# Altium schematic sheet SY_HR08_MCU_IO_V1.1.SchDoc
size A3; PageSetup: Record=PageOptions|CenterHorizontal=True|CenterVertical=True|PrintScale=0.71|XCorrection=1.00|YCorrection=1.00|PrintKind=2|BorderSize=5000000|LeftOffset=0|BottomOffset=0|Orientation=2|PaperLength=1000|PaperWidth=1000|Scale=100|PaperSource=7|PrintQuality=-3|MediaType=1|DitherType=10|PrintScaleMode=1|PaperKind=A4|PaperIndex=9
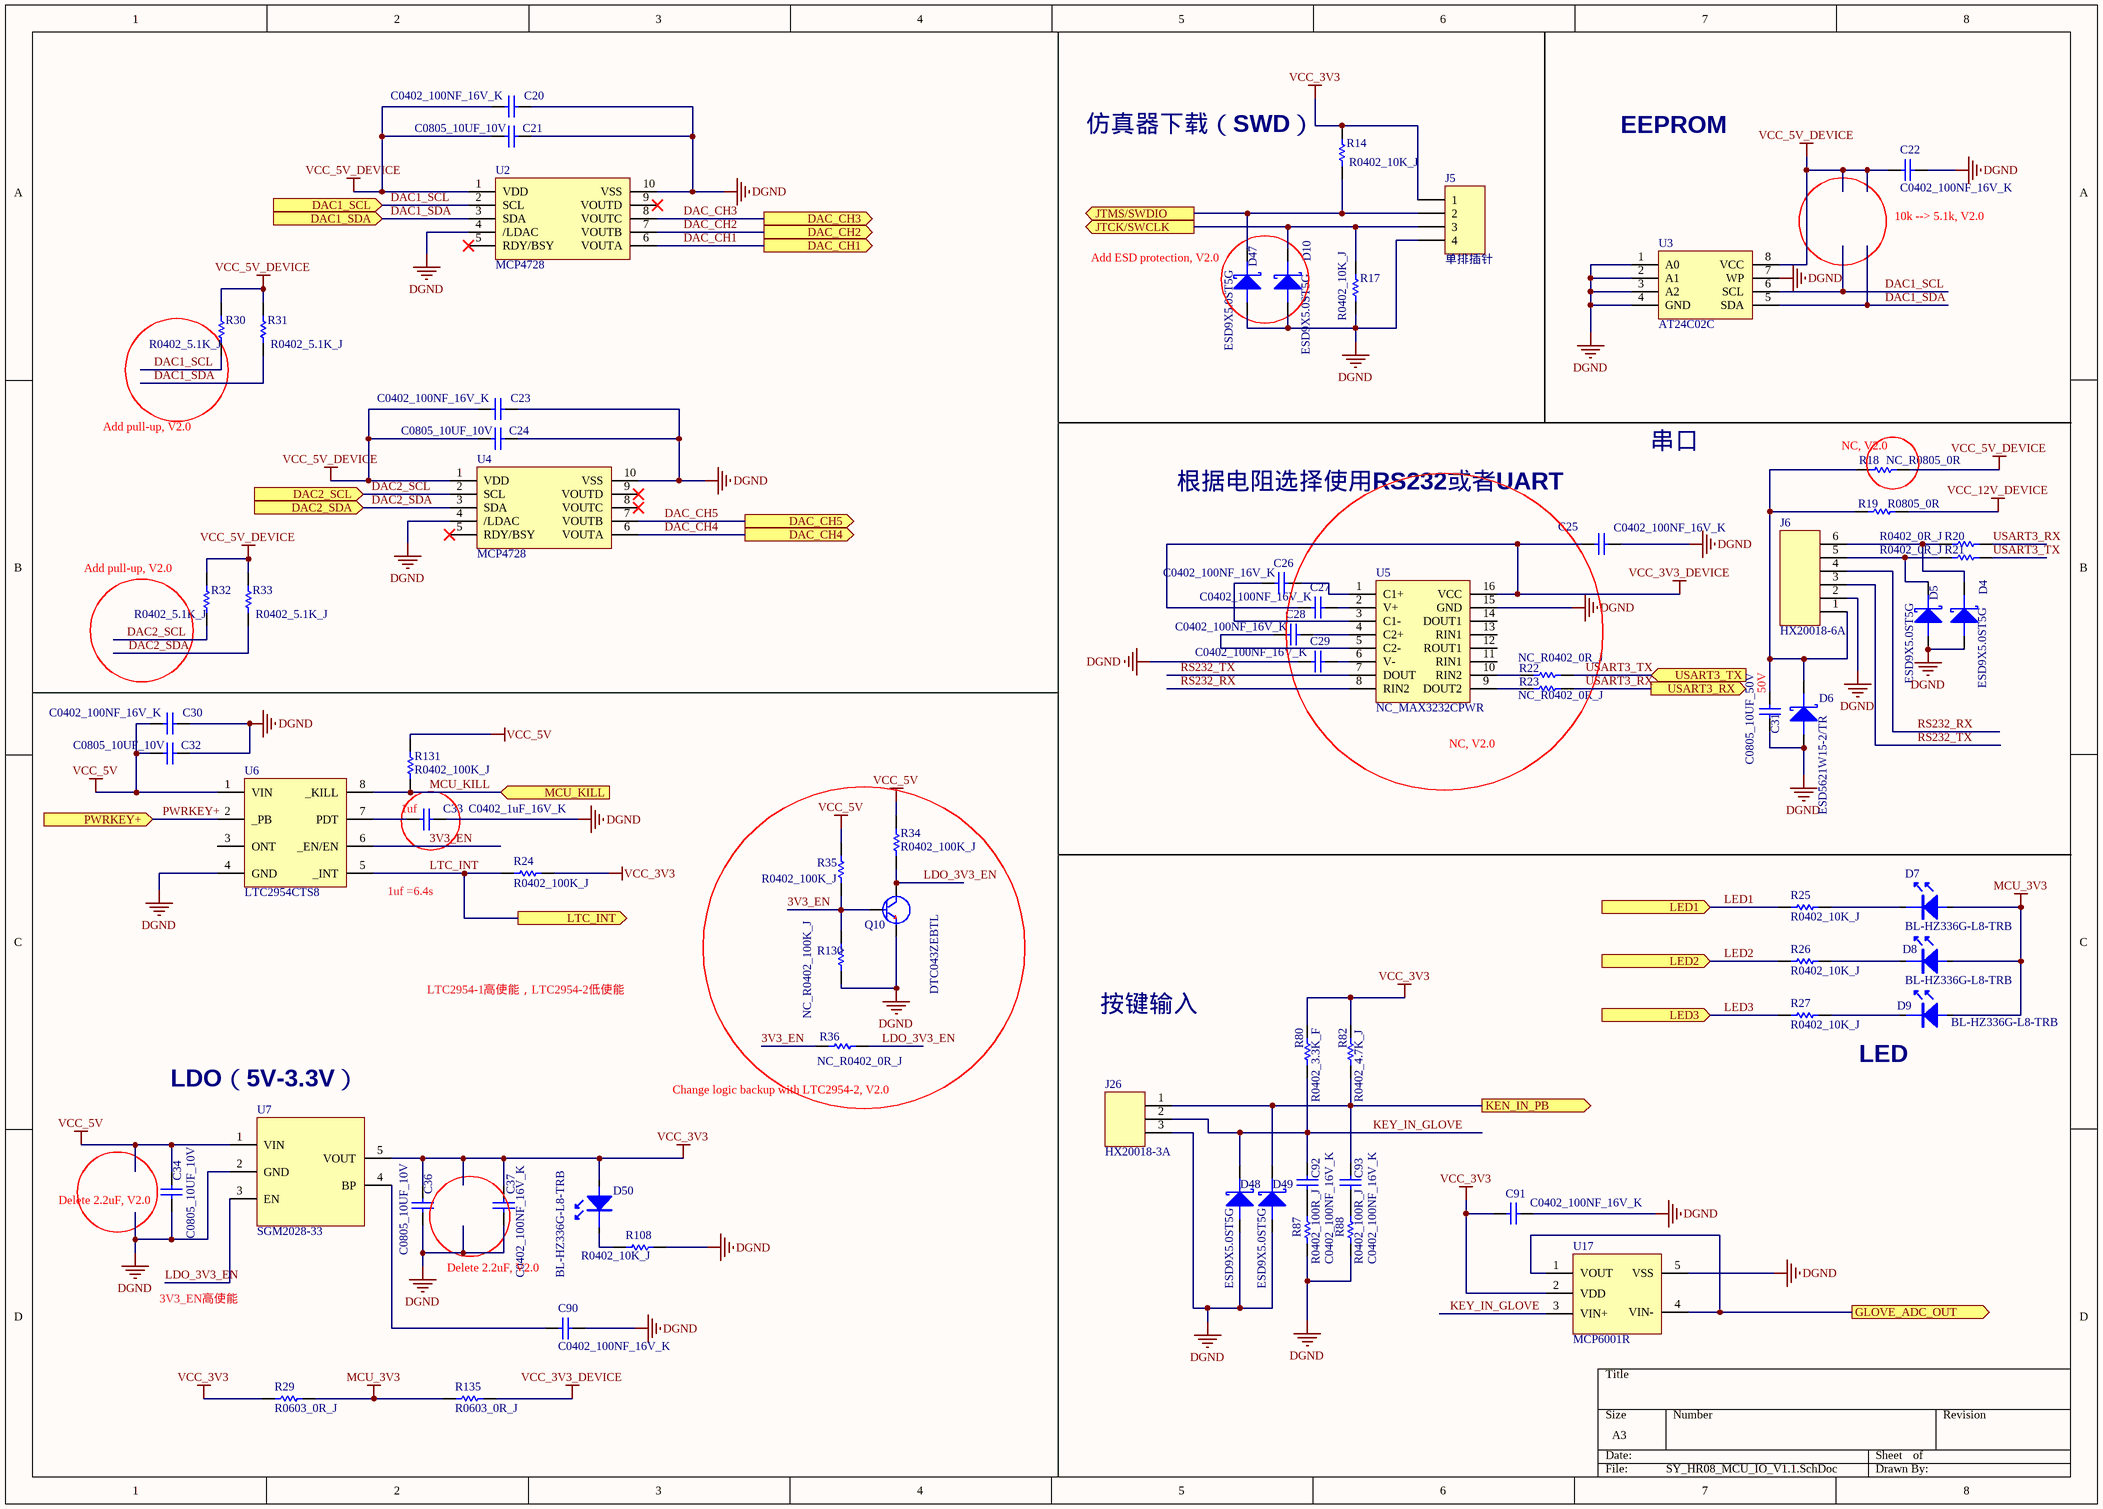
[diagram p0: SY_HR08_MCU_IO_V1.1.SchDoc]

## Parts
C20  C0402_100NF_16V_K  [CAP0402_HQ]
C21  C0805_10UF_10V  [CAP0805-B]
C22  C0402_100NF_16V_K  [CAP0402_HQ]
C23  C0402_100NF_16V_K  [CAP0402_HQ]
C24  C0805_10UF_10V  [CAP0805-B]
C25  C0402_100NF_16V_K  [CAP0402_HQ]
C26  C0402_100NF_16V_K  [CAP0402_HQ]
C27  C0402_100NF_16V_K  [CAP0402_HQ]
C28  C0402_100NF_16V_K  [CAP0402_HQ]
C29  C0402_100NF_16V_K  [CAP0402_HQ]
C30  C0402_100NF_16V_K  [CAP0402_HQ]
C31  C0805_10UF_50V  [CAP0805-B]
C32  C0805_10UF_10V  [CAP0805-B]
C33  C0402_1uF_16V_K  [CAP0402_HQ]
C34  C0805_10UF_10V  [CAP0805-B]
C36  C0805_10UF_10V  [CAP0805-B]
C37  C0402_100NF_16V_K  [CAP0402_HQ]
C90  C0402_100NF_16V_K  [CAP0402_HQ]
C91  C0402_100NF_16V_K  [CAP0402_HQ]
C92  C0402_100NF_16V_K  [CAP0402_HQ]
C93  C0402_100NF_16V_K  [CAP0402_HQ]
D4  ESD9X5.0ST5G  [ESD9X5.0ST5G]
D5  ESD9X5.0ST5G  [ESD9X5.0ST5G]
D6  ESD5621W15-2/TR  [ESD5621W15-SOD323F]
D7  BL-HZ336G-L8-TRB  [LED_1.6_0.8_0.4]
D8  BL-HZ336G-L8-TRB  [LED_1.6_0.8_0.4]
D9  BL-HZ336G-L8-TRB  [LED_1.6_0.8_0.4]
D10  ESD9X5.0ST5G  [ESD9X5.0ST5G]
D47  ESD9X5.0ST5G  [ESD9X5.0ST5G]
D48  ESD9X5.0ST5G  [ESD9X5.0ST5G]
D49  ESD9X5.0ST5G  [ESD9X5.0ST5G]
D50  BL-HZ336G-L8-TRB  [LED_1.6_0.8_0.4]
J5  单排插针  [CON1X4(2.54mm)]
J6  HX20018-6A  [HX20018-6A]
J26  HX20018-3A  [HX20018-3A]
Q10  DTC043ZEBTL  [DTC043ZEBTL$2F$$2F$DTC143ZE$2F$$2F$LDTC143ZET1G]
R14  R0402_10K_J  [RES0402_HQ]
R17  R0402_10K_J  [RES0402_HQ]
R18  NC_R0805_0R  [RES0805]
R19  R0805_0R  [RES0805]
R20  R0402_0R_J  [RES0402_HQ]
R21  R0402_0R_J  [RES0402_HQ]
R22  NC_R0402_0R_J  [RES0402_HQ]
R23  NC_R0402_0R_J  [RES0402_HQ]
R24  R0402_100K_J  [RES0402_HQ]
R25  R0402_10K_J  [RES0402_HQ-A]
R26  R0402_10K_J  [RES0402_HQ-A]
R27  R0402_10K_J  [RES0402_HQ-A]
R29  R0603_0R_J  [RES0603-A]
R30  R0402_5.1K_J  [RES0402_HQ]
R31  R0402_5.1K_J  [RES0402_HQ]
R32  R0402_5.1K_J  [RES0402_HQ]
R33  R0402_5.1K_J  [RES0402_HQ]
R34  R0402_100K_J  [RES0402_HQ]
R35  R0402_100K_J  [RES0402_HQ]
R36  NC_R0402_0R_J  [RES0402_HQ]
R80  R0402_3.3K_F  [RES0402_HQ]
R82  R0402_4.7K_J  [RES0402_HQ]
R87  R0402_100R_J  [RES0402_HQ]
R88  R0402_100R_J  [RES0402_HQ]
R108  R0402_10K_J  [RES0402_HQ-A]
R130  NC_R0402_100K_J  [RES0402_HQ]
R131  R0402_100K_J  [RES0402_HQ]
R135  R0603_0R_J  [RES0603-A]
U2  MCP4728  [MSOP-10 - 2]
U3  AT24C02C  [SOIC8_39MM]
U4  MCP4728  [MSOP-10 - 2]
U5  NC_MAX3232CPWR  [MAX3232CPWR]
U6  LTC2954CTS8  [LTC2954CTS8]
U7  SGM2028-33  [TPS7B6950]
U17  MCP6001R  [TOS23]

## Ports
DAC1_SCL (in), DAC1_SDA (in), DAC2_SCL (in), DAC2_SDA (in), DAC_CH1 (out), DAC_CH2 (out), DAC_CH3 (out), DAC_CH4 (out), DAC_CH5 (out), GLOVE_ADC_OUT (out), JTCK/SWCLK (out), JTMS/SWDIO (out), KEN_IN_PB (out), LED1 (in), LED2 (in), LED3 (in), LTC_INT (out), MCU_KILL (in), PWRKEY+ (in), USART3_RX (out), USART3_TX (in)

## Nets
DGND: C20.2 C21.1 C22.1 C23.2 C24.1 C25.2 C29.1 C30.2 C31.1 C32.1 C33.2 C34.1 C36.1 C37.1 C90.1 C91.2 D4.2 D5.2 D6.2 D10.2 D47.2 D48.2 D49.2 J5.4 J6.2 J26.3 Q10.2(E) R17.1 R87.1 R88.1 R108.2 R130.1 U2.4(/LDAC) U2.10(VSS) U3.1(A0) U3.2(A1) U3.3(A2) U3.4(GND) U3.7(WP) U4.4(/LDAC) U4.10(VSS) U5.15(GND) U6.4(GND) U7.2(GND) U17.5(VSS)
MCU_3V3: D7.2 D8.2 D9.2 R29.2 R135.1
VCC_3V3: C36.2 C37.2 C91.1 D50.2 J5.1 R14.2 R24.2 R29.1 R80.1 R82.1 U7.5(VOUT) U17.2(VDD)
VCC_3V3_DEVICE: C25.1 C27.1 R135.2 U5.16(VCC)
VCC_5V: C30.1 C32.2 C34.2 R34.2 R35.2 R131.2 U6.1(VIN) U7.1(VIN)
VCC_5V_DEVICE: C20.1 C21.2 C22.2 C23.1 C24.2 R18.2 R30.2 R31.2 R32.2 R33.2 U2.1(VDD) U3.8(VCC) U4.1(VDD)
VCC_12V_DEVICE: R19.2
3V3_EN: Q10.1(B) R35.1 R36.1 R130.2 U6.6(_EN/EN)
DAC1_SCL: R30.1 U2.2(SCL) U3.6(SCL) ; port DAC1_SCL
DAC1_SDA: R31.1 U2.3(SDA) U3.5(SDA) ; port DAC1_SDA
DAC2_SCL: R32.1 U4.2(SCL) ; port DAC2_SCL
DAC2_SDA: R33.1 U4.3(SDA) ; port DAC2_SDA
DAC_CH1: U2.6(VOUTA) ; port DAC_CH1
DAC_CH2: U2.7(VOUTB) ; port DAC_CH2
DAC_CH3: U2.8(VOUTC) ; port DAC_CH3
DAC_CH4: U4.6(VOUTA) ; port DAC_CH4
DAC_CH5: U4.7(VOUTB) ; port DAC_CH5
GLOVE_ADC_OUT: U17.1(VOUT) U17.4(VIN-) ; port GLOVE_ADC_OUT
JTCK/SWCLK: D10.1 J5.3 R17.2 ; port JTCK/SWCLK
JTMS/SWDIO: D47.1 J5.2 R14.1 ; port JTMS/SWDIO
KEN_IN_PB: C93.2 D49.1 J26.1 R82.2 ; port KEN_IN_PB
KEY_IN_GLOVE: C92.2 D48.1 J26.2 R80.2 U17.3(VIN+)
LDO_3V3_EN: Q10.3(C) R34.1 R36.2 U7.3(EN)
LED1: R25.1 ; port LED1
LED2: R26.1 ; port LED2
LED3: R27.1 ; port LED3
LTC_INT: R24.1 U6.5(_INT) ; port LTC_INT
MCU_KILL: R131.1 U6.8(_KILL) ; port MCU_KILL
PWRKEY+: U6.2(_PB) ; port PWRKEY+
RS232_RX: J6.4 U5.8(RIN2)
RS232_TX: J6.3 U5.7(DOUT)
USART3_RX: R20.2 R23.2 ; port USART3_RX
USART3_TX: R21.2 R22.2 ; port USART3_TX
NetC26_1: C26.1 U5.3(C1-)
NetC26_2: C26.2 U5.1(C1+)
NetC27_2: C27.2 U5.2(V+)
NetC28_1: C28.1 U5.5(C2-)
NetC28_2: C28.2 U5.4(C2+)
NetC29_2: C29.2 U5.6(V-)
NetC31_2: C31.2 D6.1 J6.1 R18.1 R19.1
NetC33_1: C33.1 U6.7(PDT)
NetC90_2: C90.2 U7.4(BP)
NetC92_1: C92.1 R87.2
NetC93_1: C93.1 R88.2
NetD4_1: D4.1 J6.6 R20.1
NetD5_1: D5.1 J6.5 R21.1
NetD7_1: D7.1 R25.2
NetD8_1: D8.1 R26.2
NetD9_1: D9.1 R27.2
NetD50_1: D50.1 R108.1
NetR22_1: R22.1 U5.10(RIN2)
NetR23_1: R23.1 U5.9(DOUT2)

Not connected (* = marked no-connect by the designer): U2 5(RDY/BSY)* 9(VOUTD)*; U4 5(RDY/BSY)* 8(VOUTC)* 9(VOUTD)*; U5 11(RIN1) 12(ROUT1) 13(RIN1) 14(DOUT1); U6 3(ONT)

## Notes on the sheet
- 仿真器下载（SWD）
- EEPROM
- (near C22) 10k --> 5.1k, V2.0
- (near D47) Add ESD protection, V2.0
- Add pull-up, V2.0
- 串口
- (near R18) NC, V2.0
- 根据电阻选择使用RS232或者UART
- (near R32) Add pull-up, V2.0
- (near C31) 50V
- NC, V2.0
- (near C33) 1uf
- 1uf =6.4s
- LTC2954-1高使能，LTC2954-2低使能
- 按键输入
- (near U7) LDO（5V-3.3V）
- (near R36) Change logic backup with LTC2954-2, V2.0
- (near D9) LED
- (near C34) Delete 2.2uF, V2.0
- 3V3_EN高使能
- Delete 2.2uF, V2.0

## Library data of the parts
C20 C22 C23 C25-C30 C33 C37 C90-C93 = C0402_100NF_16V_K: 电容_100nF_0402_X7R_16V_K; Geometry.Height: 0.55mm; Value: 100NF
C21 C24 C31 C32 C34 C36 = C0805_10UF_10V: 电容_10uF_0805_X5R_10V_K
D4 D5 D10 D47-D49 = ESD9X5.0ST5G: TVS_单路_单向_5.0V_65pF; Manufacturer: ONSEMI(安森美); Part Number: HQ11510010010; Geometry.Height: 0.43mm
D6 = ESD5621W15-2/TR: TVS_浪涌+静电二合一管_单向_15V_270pf
D7-D9 D50 = BL-HZ336G-L8-TRB: LED_(白色_0603_2.8V)_(HUE仅收5-5,5-6,5-7的标示，CAE仅收含P的标示); Manufacturer: Bright(佰鸿); Geometry.Height: 0.6mm
J5 = Header 4: Header, 4-Pin; LatestRevisionDate: 17-Jul-2002; LatestRevisionNote: Re-released for DXP Platform.; Publisher: Altium Limited
J6 = HX20018-6A: HX20018-6A  2.0mm
J26 = HX20018-3A: HX20018-3A  2.0mm
Q10 = DTC043ZEBTL: NPN三极管_100mA_EMT3F
R14 R17 R24 R30-R36 R130 R131 = R0402_10K_J: 电阻10K(0402-0.0625W-J)
R18 R19 = R0805_0R: 电阻0R(0805-0.125W-J); Value: 0R
R20-R23 = R0402_0R_J: 电阻0R(0402-0.0625W-J)
R25-R27 R108 = R0402_1K_1/16W_J: 电阻_1K(0402-0.0625W-J); Value: 1K
R29 R135 = R0603_0R_J: 电阻0R(0603-0.1W-J)
R80 R82 = R0402_4.7K_J: 电阻4.7K(0402-0.0625W-J)
R87 R88 = R0402_100R_J: 电阻100R(0402-0.0625W-J)
U2 U4 = MCP4728: MCP4728  4路DAC  I2C   MSOP10
U3 = AT24C02C: 2K位串行CMOS E2PROM I2C接口
U5 = MAX3232CPWR: UART转RS232 芯片; Manufacturer: TI; Geometry.Height: 1.2mm; Value: MAX3232CPWR
U6 = LTC2954CTS8: Pushbutton On/Off
U7 = RT9193-33: 单电池电压转换器  3.3V; Geometry.Height: 1.45mm
U17 = MCP6001R: 1MHz, Low-Power Op Amp